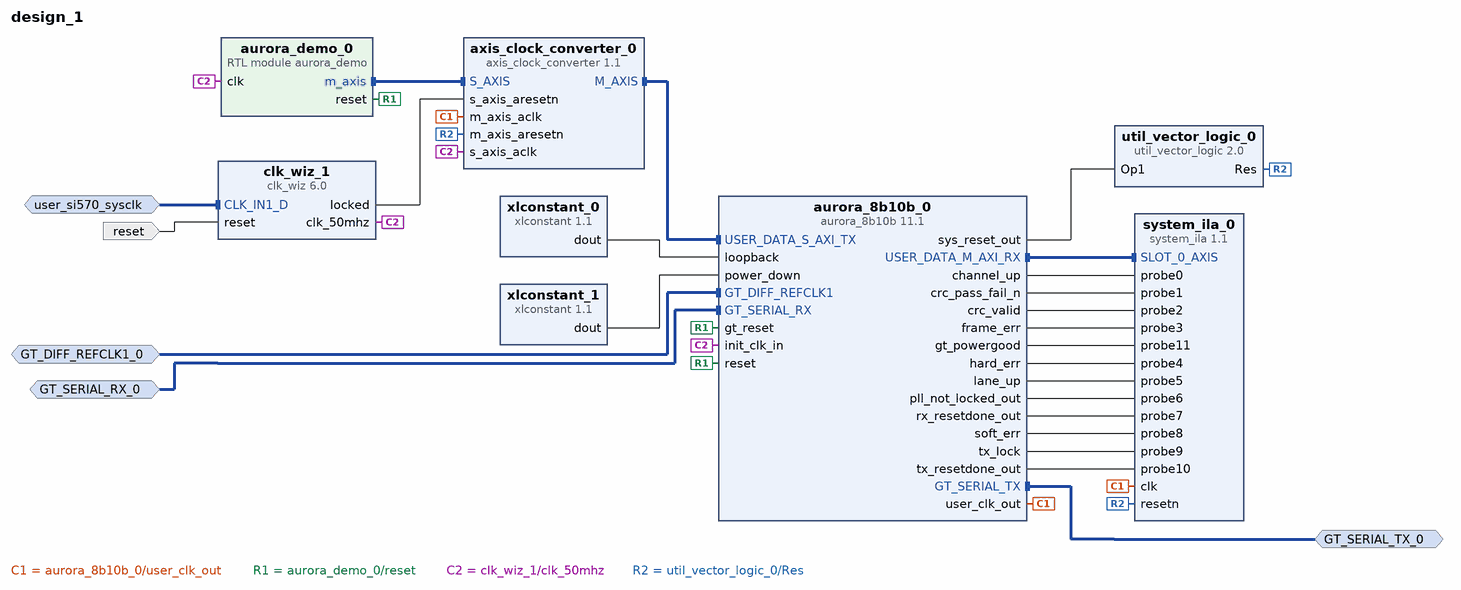
[diagram p0: block diagram of the top level]
# Vivado block design design_1, xczu7ev-ffvc1156-2-e, Vivado 2021.1
create_bd_design design_1

create_bd_intf_port -mode Slave -vlnv xilinx.com:interface:diff_clock_rtl:1.0 user_si570_sysclk
set_property -dict {CONFIG.FREQ_HZ 300000000} [get_bd_intf_ports user_si570_sysclk]
create_bd_intf_port -mode Slave -vlnv xilinx.com:display_aurora:GT_Serial_Transceiver_Pins_RX_rtl:1.0 GT_SERIAL_RX_0
create_bd_intf_port -mode Master -vlnv xilinx.com:display_aurora:GT_Serial_Transceiver_Pins_TX_rtl:1.0 GT_SERIAL_TX_0
create_bd_intf_port -mode Slave -vlnv xilinx.com:interface:diff_clock_rtl:1.0 GT_DIFF_REFCLK1_0
set_property -dict {CONFIG.FREQ_HZ 250000000} [get_bd_intf_ports GT_DIFF_REFCLK1_0]
create_bd_port -dir I -type rst reset
set_property -dict {CONFIG.POLARITY ACTIVE_HIGH} [get_bd_ports reset]

create_bd_cell -type ip -vlnv xilinx.com:ip:aurora_8b10b:11.1 aurora_8b10b_0
set_property -dict [list \
  CONFIG.CHANNEL_ENABLE X0Y10 \
  CONFIG.C_DRP_IF false \
  CONFIG.C_LANE_WIDTH 4 \
  CONFIG.C_LINE_RATE 6.6 \
  CONFIG.C_REFCLK_FREQUENCY 132 \
  CONFIG.C_REFCLK_SOURCE {MGTREFCLK1 of Quad X0Y2} \
  CONFIG.C_START_LANE X0Y10 \
  CONFIG.C_START_QUAD Quad_X0Y2 \
  CONFIG.C_USE_CRC true \
  CONFIG.SINGLEEND_GTREFCLK false \
  CONFIG.SupportLevel 1 \
] [get_bd_cells aurora_8b10b_0]
create_bd_cell -type ip -vlnv xilinx.com:ip:clk_wiz:6.0 clk_wiz_1
set_property -dict [list \
  CONFIG.CLKIN1_JITTER_PS 33.330000000000005 \
  CONFIG.CLKOUT1_JITTER 116.415 \
  CONFIG.CLKOUT1_PHASE_ERROR 77.836 \
  CONFIG.CLKOUT1_REQUESTED_OUT_FREQ 50.000 \
  CONFIG.CLK_IN1_BOARD_INTERFACE user_si570_sysclk \
  CONFIG.CLK_OUT1_PORT clk_50mhz \
  CONFIG.MMCM_CLKFBOUT_MULT_F 4.000 \
  CONFIG.MMCM_CLKIN1_PERIOD 3.333 \
  CONFIG.MMCM_CLKIN2_PERIOD 10.0 \
  CONFIG.MMCM_CLKOUT0_DIVIDE_F 24.000 \
  CONFIG.PRIM_SOURCE Differential_clock_capable_pin \
  CONFIG.RESET_BOARD_INTERFACE reset \
  CONFIG.USE_BOARD_FLOW true \
] [get_bd_cells clk_wiz_1]
create_bd_cell -type ip -vlnv xilinx.com:ip:xlconstant:1.1 xlconstant_0
set_property -dict {CONFIG.CONST_VAL 0 CONFIG.CONST_WIDTH 3} [get_bd_cells xlconstant_0]
create_bd_cell -type ip -vlnv xilinx.com:ip:xlconstant:1.1 xlconstant_1
set_property -dict {CONFIG.CONST_VAL 0} [get_bd_cells xlconstant_1]
create_bd_cell -type module -reference aurora_demo aurora_demo_0
create_bd_cell -type ip -vlnv xilinx.com:ip:system_ila:1.1 system_ila_0
set_property -dict [list \
  CONFIG.C_DATA_DEPTH 16384 \
  CONFIG.C_MON_TYPE MIX \
  CONFIG.C_NUM_MONITOR_SLOTS 1 \
  CONFIG.C_NUM_OF_PROBES 12 \
  CONFIG.C_SLOT 0 \
  CONFIG.C_SLOT_0_INTF_TYPE xilinx.com:interface:axis_rtl:1.0 \
  CONFIG.C_SLOT_1_INTF_TYPE xilinx.com:interface:axis_rtl:1.0 \
] [get_bd_cells system_ila_0]
create_bd_cell -type ip -vlnv xilinx.com:ip:axis_clock_converter:1.1 axis_clock_converter_0
create_bd_cell -type ip -vlnv xilinx.com:ip:util_vector_logic:2.0 util_vector_logic_0
set_property -dict {CONFIG.C_OPERATION not CONFIG.C_SIZE 1} [get_bd_cells util_vector_logic_0]

# ---- connections ----

connect_bd_intf_net -intf_net GT_DIFF_REFCLK1_0_1 [get_bd_intf_ports GT_DIFF_REFCLK1_0] [get_bd_intf_pins aurora_8b10b_0/GT_DIFF_REFCLK1]
connect_bd_intf_net -intf_net GT_SERIAL_RX_0_1 [get_bd_intf_ports GT_SERIAL_RX_0] [get_bd_intf_pins aurora_8b10b_0/GT_SERIAL_RX]
connect_bd_intf_net [get_bd_intf_ports GT_SERIAL_TX_0] [get_bd_intf_pins aurora_8b10b_0/GT_SERIAL_TX]
connect_bd_intf_net [get_bd_intf_pins aurora_8b10b_0/USER_DATA_M_AXI_RX] [get_bd_intf_pins system_ila_0/SLOT_0_AXIS]
connect_bd_intf_net [get_bd_intf_pins axis_clock_converter_0/S_AXIS] [get_bd_intf_pins aurora_demo_0/m_axis]
connect_bd_intf_net [get_bd_intf_pins axis_clock_converter_0/M_AXIS] [get_bd_intf_pins aurora_8b10b_0/USER_DATA_S_AXI_TX]
connect_bd_intf_net [get_bd_intf_ports user_si570_sysclk] [get_bd_intf_pins clk_wiz_1/CLK_IN1_D]
connect_bd_net [get_bd_pins aurora_8b10b_0/channel_up] [get_bd_pins system_ila_0/probe0]
connect_bd_net [get_bd_pins aurora_8b10b_0/crc_pass_fail_n] [get_bd_pins system_ila_0/probe1]
connect_bd_net [get_bd_pins aurora_8b10b_0/crc_valid] [get_bd_pins system_ila_0/probe2]
connect_bd_net [get_bd_pins aurora_8b10b_0/frame_err] [get_bd_pins system_ila_0/probe3]
connect_bd_net [get_bd_pins aurora_8b10b_0/gt_powergood] [get_bd_pins system_ila_0/probe11]
connect_bd_net [get_bd_pins aurora_8b10b_0/hard_err] [get_bd_pins system_ila_0/probe4]
connect_bd_net [get_bd_pins aurora_8b10b_0/lane_up] [get_bd_pins system_ila_0/probe5]
connect_bd_net [get_bd_pins aurora_8b10b_0/pll_not_locked_out] [get_bd_pins system_ila_0/probe6]
connect_bd_net [get_bd_pins aurora_8b10b_0/rx_resetdone_out] [get_bd_pins system_ila_0/probe7]
connect_bd_net [get_bd_pins aurora_8b10b_0/soft_err] [get_bd_pins system_ila_0/probe8]
connect_bd_net [get_bd_pins aurora_8b10b_0/sys_reset_out] [get_bd_pins util_vector_logic_0/Op1]
connect_bd_net [get_bd_pins aurora_8b10b_0/tx_lock] [get_bd_pins system_ila_0/probe9]
connect_bd_net [get_bd_pins aurora_8b10b_0/tx_resetdone_out] [get_bd_pins system_ila_0/probe10]
connect_bd_net [get_bd_pins aurora_8b10b_0/user_clk_out] [get_bd_pins system_ila_0/clk] [get_bd_pins axis_clock_converter_0/m_axis_aclk]
connect_bd_net [get_bd_pins aurora_demo_0/reset] [get_bd_pins aurora_8b10b_0/reset] [get_bd_pins aurora_8b10b_0/gt_reset]
connect_bd_net -net clk_wiz_1_clk_100mhz [get_bd_pins clk_wiz_1/clk_50mhz] \
  [get_bd_pins aurora_8b10b_0/init_clk_in] [get_bd_pins aurora_demo_0/clk] [get_bd_pins axis_clock_converter_0/s_axis_aclk]
connect_bd_net [get_bd_pins clk_wiz_1/locked] [get_bd_pins axis_clock_converter_0/s_axis_aresetn]
connect_bd_net [get_bd_ports reset] [get_bd_pins clk_wiz_1/reset]
connect_bd_net [get_bd_pins util_vector_logic_0/Res] [get_bd_pins system_ila_0/resetn] [get_bd_pins axis_clock_converter_0/m_axis_aresetn]
connect_bd_net [get_bd_pins xlconstant_0/dout] [get_bd_pins aurora_8b10b_0/loopback]
connect_bd_net [get_bd_pins xlconstant_1/dout] [get_bd_pins aurora_8b10b_0/power_down]

validate_bd_design
save_bd_design
